# EAGLE design downstairs_breakout (EAGLE 5.10)
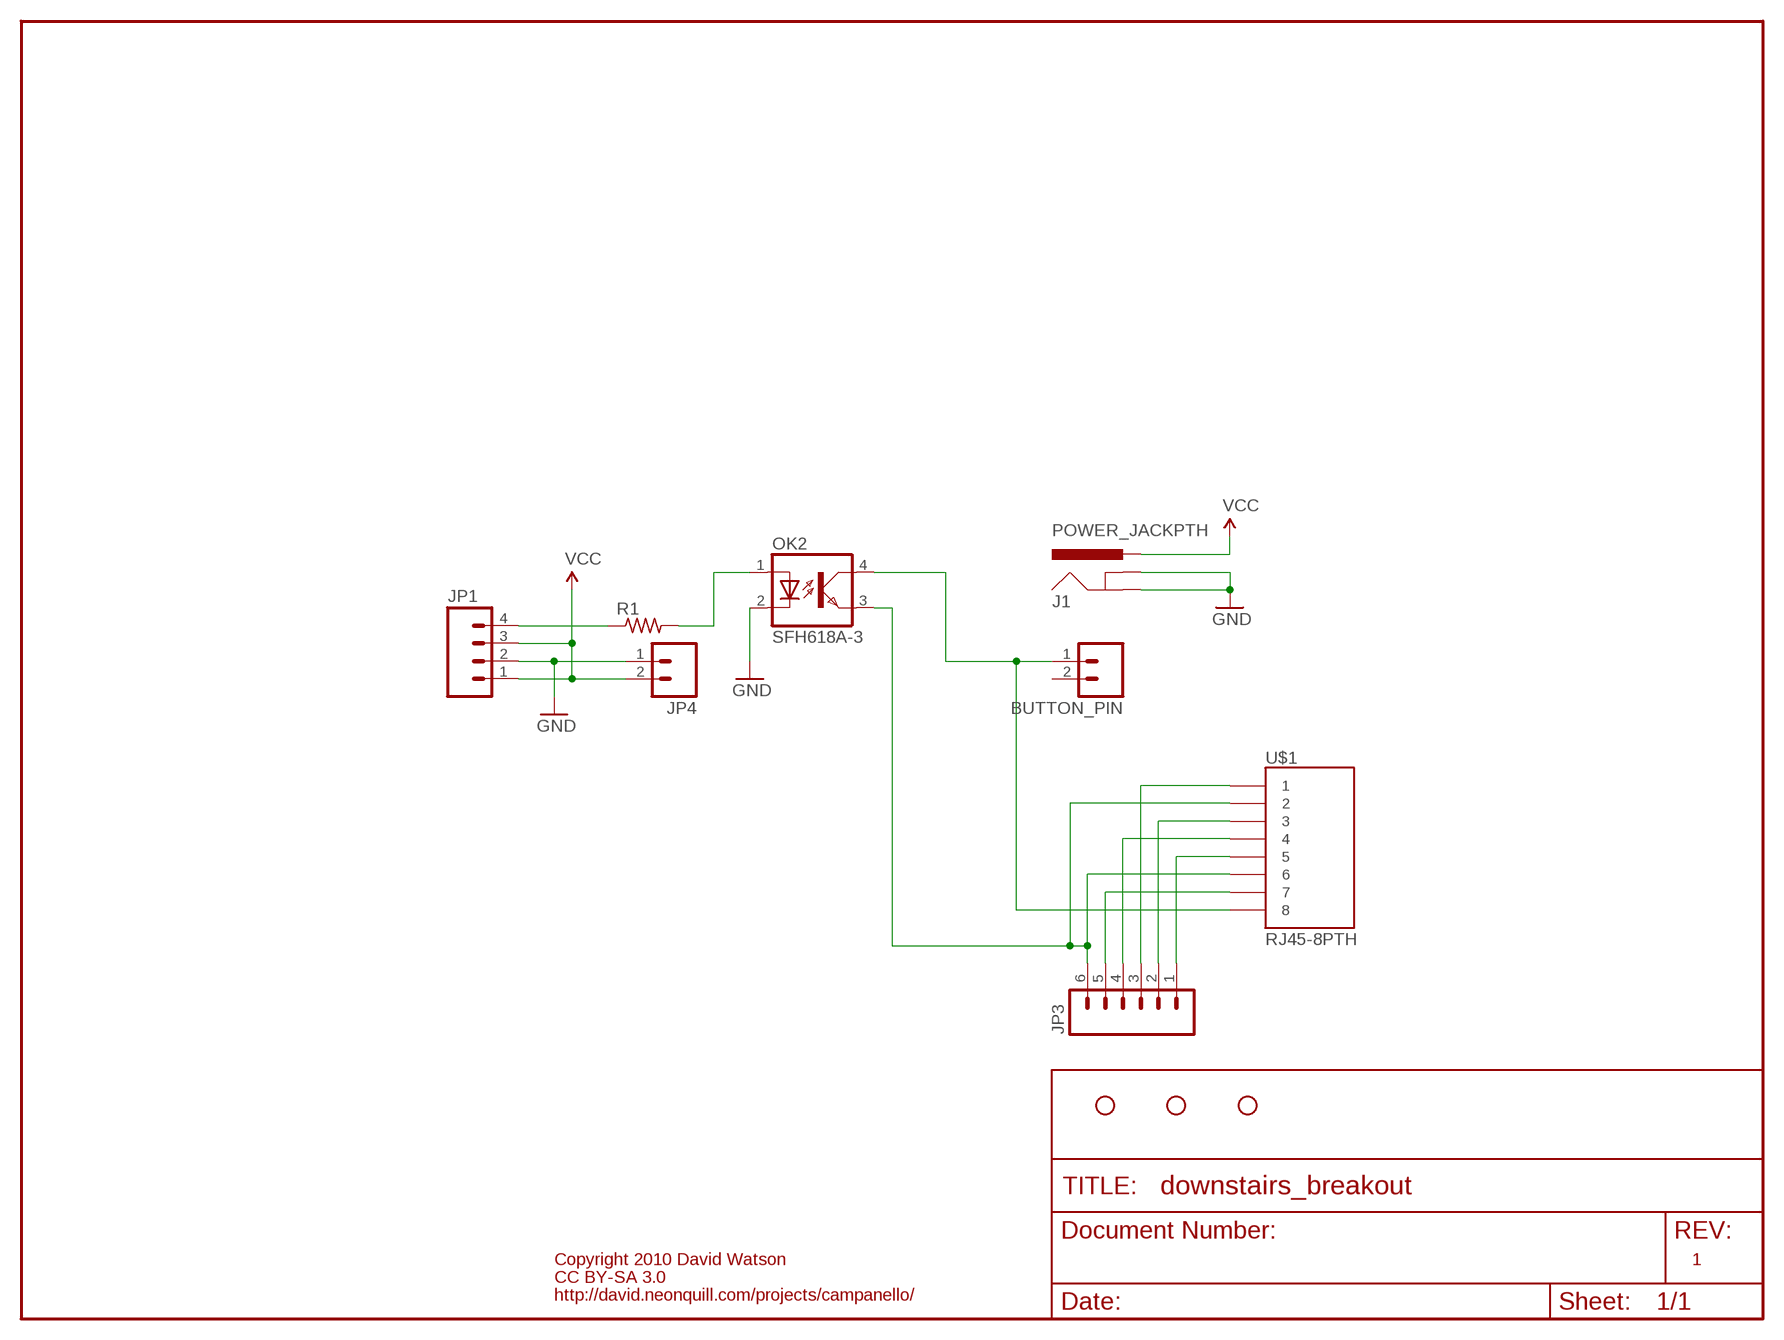
[diagram p0: schematic, sheet 1]

## Parts
BUTTON_PIN  M023.5MM_LOCK  [SCREWTERMINAL-3.5MM-2_LOCK]
J1  POWER_JACKPTH  [POWER_JACK_PTH]
JP1  M04SCREW  [SCREWTERMINAL-3.5MM-4]
JP3  M06LOCK  [1X06_LOCK]
JP4  M02LOCK  [1X02_LOCK]
JP8  STAND-OFF  [STAND-OFF]
JP9  STAND-OFF  [STAND-OFF]
JP10  STAND-OFF  [STAND-OFF]
OK2  SFH618A-3  [DIP4]
R1  R-US_0207/10  [0207/10]
U$1  RJ45-8PTH  [RJ45-8]

## Nets
GND: J1.GND J1.GNDBREAK JP1.2 JP4.1 OK2.2(C)
N$1: JP3.3 U$1.1
N$2: JP1.4 R1.1
N$3: JP3.2 U$1.3
N$4: JP3.4 U$1.4
N$5: JP3.1 U$1.5
N$6: OK2.1(A) R1.2
N$7: JP3.5 U$1.7
N$8: BUTTON_PIN.1 OK2.4(COL) U$1.8
N$9: JP3.6 OK2.3(EMIT) U$1.2 U$1.6
VCC: J1.PWR JP1.1 JP1.3 JP4.2
Unconnected: BUTTON_PIN.2

## Notes on the sheet
- Copyright 2010 David Watson | 1
- CC BY-SA 3.0
- http://david.neonquill.com/projects/campanello/

## Library data of the parts
BUTTON_PIN JP4 = SparkFun:M02: Header 2 Standard 2-pin 0.1" header. Use with straight break away headers (SKU : PRT-00116), right angle break away headers (PRT-00553), swiss pins (PRT-00743), machine pins (PRT-00117), and female headers (PRT-00115). Molex polarized connector foot print use with SKU : PRT-08233 with associated crimp pins and housings.
J1 = SparkFun:POWER_JACK: Power Jack This is the standard 5.5mm barrel jack for power. The PTH is the most common, proven, reliable, footprint. All others are experimental. The Slot footprint only works if the mill layer is transmitted to the PCB fab house so be warned. Spark Fun Electronics SKU : PRT-00119. Mating wall wart : TOL-00298 (and others)
JP1 = SparkFun:M04: Header 4 Standard 4-pin 0.1" header. Use with straight break away headers (SKU : PRT-00116), right angle break away headers (PRT-00553), swiss pins (PRT-00743), machine pins (PRT-00117), and female headers (PRT-00115). Molex polarized connector foot print use with SKU : PRT-08231 with associated crimp pins and housings.
JP3 = SparkFun:M06: Header 6 Standard 6-pin 0.1" header. Use with straight break away headers (SKU : PRT-00116), right angle break away headers (PRT-00553), swiss pins (PRT-00743), machine pins (PRT-00117), and female headers (PRT-00115). Molex polarized connector foot print use with SKU : PRT-08094 with associated crimp pins and housings. NOTES ON THE VARIANTS LOCK and LOCK_LONGPADS... This footprint was designed to help hold the alignment of a through-hole component (i.e. 6-pin header) while soldering it into place. You may notice that each hole has been shifted either up or down by 0.005 of an inch from it's more standard position (which is a perfectly straight line). This slight alteration caused the pins (the squares in the middle) to touch the edges of the holes. Because they are alternating, it causes a "brace" to hold the component in place. 0.005 has proven to be the perfect amount of "off-center" position when using our standard breakaway headers. Although looks a little odd when you look at the bare footprint, once you have a header in there, the alteration is very hard to notice. Also, if you push a header all the way into place, it is covered up entirely on the bottom side. This idea of altering the position of holes to aid alignment will be further integrated into the Sparkfun Library for other footprints. It can help hold any component with 3 or more connection pins.
JP8-JP10 = SparkFun:STAND-OFF: Stand Off This is the mechanical footprint for a #4 phillips button head screw. Use the keepout ring to avoid running the screw head into surrounding components. SKU : PRT-00447
OK2 = optocoupler:SFH618?*: Optocoupler, Phototransistor Output, Low Input Current Source: http://www.vishay.com/docs/83673/sfh618.pdf
R1 = rcl:R-US_: RESISTOR, American symbol
U$1 = SparkFun:RJ45-8: RJ45 Jack Simple RJ45, 8-pin connection - connector for common Cat5, Cat5e, and Cat6 Ethernet cables. Footprint not yet proven in production. Connector sku is PRT-00643; Breakout PCB sku is BOB-00716.

## Net classes
0 default: width 0.406 mm, clearance 0.406 mm

## Board
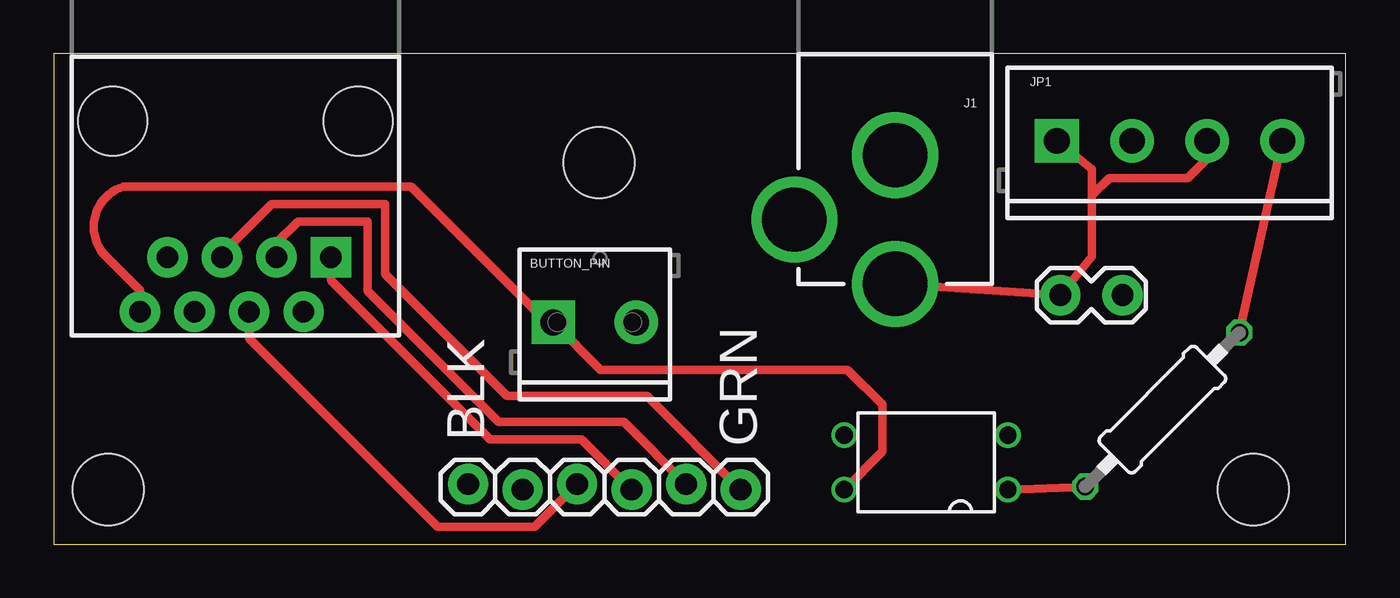
[diagram p1: board, top side]
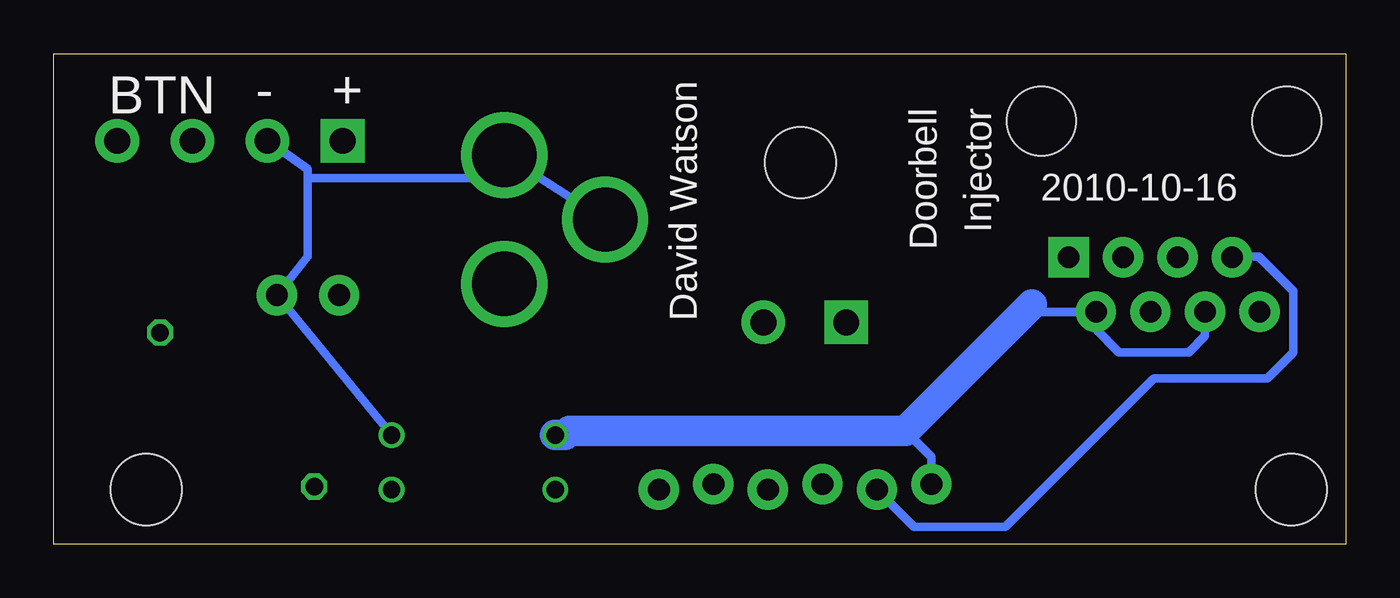
[diagram p2: board, bottom side, seen from below]

Size 60.2 x 22.86 mm. Coordinates in mm from the lower left corner, seen from the top.
Outline: 0,0 60.2,0 60.2,22.86 0,22.86 0,0
Copper layers (1*16): Top 0.0356mm / dielectric 1.5011mm / Bottom 0.0356mm
Design rules "LaenPCBOrder *": minimum track width 16mil, minimum drill 13mil, track to track 16mil, track to pad 16mil, pad to pad 6mil, via to via 6mil, smd to smd 6mil, copper to edge 15mil, drill to drill 6mil, minimum pad ring 7mil, minimum via ring 7mil, stop-mask expansion 4mil, vias tented up to drill 0mil, thermal gap 10mil

### Footprints (pad centres in the part's own frame; a part is rotated, then mirrored left to right if it is on the bottom)
SCREWTERMINAL-3.5MM-2_LOCK = drill 1.2 pad 2.032 square: 1 -0.178,0 | drill 1.2 pad 2.032 round: 2 3.678,0
POWER_JACK_PTH = drill 2.997 round: GND 0,7.7; GNDBREAK 4.7,10.7; PWR 0,13.7
SCREWTERMINAL-3.5MM-4 = drill 1.2 pad 2.032 square: 1 0,0 | drill 1.2 pad 2.032 round: 2 3.5,0; 3 7,0; 4 10.5,0
1X06_LOCK = drill 1.016 pad 1.88 round: 1 0,0; 2 2.54,-0.254; 3 5.08,0; 4 7.62,-0.254; 5 10.16,0; 6 12.7,-0.254
1X02_LOCK = drill 1.016 pad 1.88 round: 1 -0.178,0; 2 2.718,0
STAND-OFF = hole 3.302: 0,0
DIP4 = drill 0.8 round: 1 -1.27,-3.81; 2 1.27,-3.81; 3 1.27,3.81; 4 -1.27,3.81
0207/10 = drill 0.813 octagon: 1 -5.08,0; 2 5.08,0
RJ45-8 = drill 1 pad 1.88 square: 1 -4.445,6.35 | drill 1 pad 1.88 round: 2 -3.175,8.89; 3 -1.905,6.35; 4 -0.635,8.89; 5 0.635,6.35; 6 1.905,8.89; 7 3.175,6.35; 8 4.445,8.89 | hole 3.2: -5.715,0; 5.715,0

### Placement (x,y rotation side)
BUTTON_PIN  23.46,10.33 0 top
J1  39.2,25.83 180 top
JP1  46.74,18.8 0 top
JP3  32,2.54 180 top
JP4  49.62,11.6 180 top
JP8  2.54,2.54 0 top
JP9  25.4,17.78 0 top
JP10  55.88,2.54 0 top
OK2  40.64,3.81 90 top
R1  51.65,6.27 225 top
U$1  8.47,19.71 180 top

### Tracks (layer width: path | path; a pad name or v marks a point on that pad's centre or on a via)
GND
  Bottom 0.406: JP1.2 48.36,17.48 48.36,17.07 | 48.36,17.07 48.36,13.41 JP4.1 OK2.2 | J1.GNDBREAK J1.GND 40.26,17.07 48.36,17.07
N$1
  Top 0.406: U$1.1 12.91,12.28 20.32,4.88 24.59,4.88 JP3.3
N$2
  Top 0.406: R1.1 JP1.4
N$3
  Top 0.406: U$1.3 10.38,14.03 11.38,15.04 14.63,15.04 14.63,11.79 20.73,5.69 26.57,5.69 JP3.2
N$4
  Top 0.406: U$1.4 9.11,9.59 17.88,0.81 22.4,0.81 JP3.4
N$5
  Top 0.406: U$1.5 7.83,13.53 10.16,15.85 15.44,15.85 15.44,12.6 21.13,6.91 27.64,6.91 JP3.1
N$6
  Top 0.406: OK2.1 R1.2
N$7
  Bottom 0.406: JP3.5 20.12,0.81 15.85,0.81 8.94,7.72 3.66,7.72 2.44,8.94 2.44,11.79 4.06,13.41 5.25,13.41 U$1.7
N$8
  Top 0.406: U$1.8 4.03,11.82 2.44,13.41 arc-118 3.25,16.66 16.66,16.66 22.99,10.33 BUTTON_PIN.1 25.48,8.13 36.98,8.13 38.61,6.5 38.61,4.32 OK2.4
N$9
  Bottom 0.406: 14.63,11.18 14.28,10.82 U$1.2 11.64,10.02 10.57,8.94 7.32,8.94 6.57,9.69 U$1.6 | JP3.6 19.3,4.06 20.52,5.28
  Bottom 1.422: OK2.3 36.37,5.08 36.17,5.28 20.52,5.28 14.63,11.18
VCC
  Top 0.406: JP1.1 48.36,17.48 48.36,16.26 | 48.36,16.26 48.36,13.41 JP4.2 J1.PWR | JP1.3 53.74,17.97 52.83,17.07 49.17,17.07 48.36,16.26

### Text on the board
tPlace: BLK | GRN
bPlace: David Watson | Injector | Doorbell | + | - | BTN | 2010-10-16
tDocu: Copyright 2010 David Watson | CC BY-SA 3.0